# Altium schematic sheet PartsTemplate.SchDoc
size A4
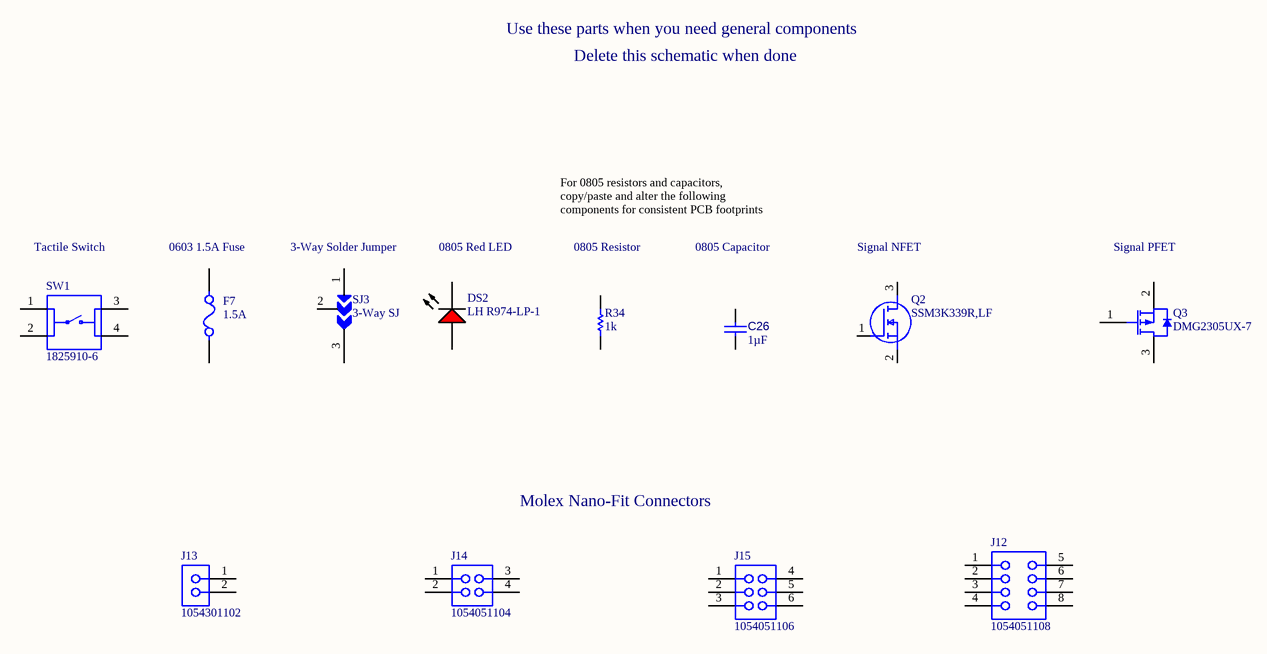
[diagram p0: PartsTemplate.SchDoc]

## Parts
C26  1µF  [CAPC2013X145X50ML20T25]
DS2  LH R974-LP-1  [OSRM-LH R974_V]
F7  1.5A  [FUSC1608X43N]
J12  1054051108  [1054051108]
J13  1054301102  [1054301102]
J14  1054051104  [1054051104]
J15  1054051106  [1054051106]
Q2  SSM3K339R,LF  [SOTFL95P240X88-3N]
Q3  DMG2305UX-7  [DIOD-SOT23-3_A_V]
R34  1k  [RESC2013X50X35ML15T15]
SJ3  3-Way SJ  [3-Way SJ]
SW1  1825910-6  [SW_1825910-6-4]

## Nets

Not connected (* = marked no-connect by the designer): C26 1 2; DS2 1(A) 2(K); F7 1 2; J12 1 2 3 4 5 6 7 8; J13 1 2; J14 1 2 3 4; J15 1 2 3 4 5 6; Q2 1(G) 2(S) 3(D); Q3 1(GATE) 2(SOURCE) 3(DRAIN); R34 1 2; SJ3 1 2 3; SW1 1 2 3 4

## Notes on the sheet
- Use these parts when you need general components
- Delete this schematic when done
- Tactile Switch
- (near F7) 0603 1.5A Fuse
- (near SJ3) 3-Way Solder Jumper
- 0805 Red LED
- For 0805 resistors and capacitors, copy/paste and alter the following components for consistent PCB footprints
- 0805 Resistor
- 0805 Capacitor
- (near Q2) Signal NFET
- Signal PFET
- Molex Nano-Fit Connectors

## Library data of the parts
C26 = CMP-001-00010-4: Chip Capacitor, 1 uF, +/-10%, 25 V, 0805 (2012 Metric); Tolerance: 10%; Capacitor Type: Ceramic; Voltage Rating: 25V; Mounting Technology: SM; Case/Package: 0805; Max Operating Temperature: 125°C; RoHS Compliant: True; Value: 1µF; Min Operating Temperature: -55°C; Pins: 2
DS2 = CMP-2000-06540-1: LED Uni-Color Red, 1.8 V, -30 to 85 degC, 2-Pin SMD, RoHS, Tape and Reel; Manufacturer: OSRAM; Dominant Wave Length: 645nm; Peak Wavelength: 660nm; Chip Material: GaAlAs; Main Category: ChipLED; Luminous Intensity: 71mcd; Rad Hardened: No; Product Depth (mm): 1.35mm; Test Current (It): 20mA; Lens Type: ColorlessDiffused; Forward Current: 30mA; Viewing Angle: 160deg; Product Length (mm): 2.1mm; Reverse Voltage: 5V; Number of  Elements: 1; Luminous Flux: 0.17lm; Shape Type: Rectangular; Product Height (mm): 0.9mm; Forward Voltage: 2.6V; Package Description: 2-Pin Surface Mount Device, Body 1.25 x 2 mm; Operating Temperature Classification: Commercial; Emitting Color: Red; Pin Count: 2; Type: Uni-Color; Packaging: TapeandReel; High Brightness: No; Datasheet URL: https://datasheet.ciiva.com/26941/getdatasheetpartid-258950-26941914.pdf; Operating Temp Range: -30Cto85C; Lens Dimensions: 1.4x1.35x0.5mm; Package Type: ChipLed; Datasheet Version: Rev. 1.0, 11/2012; Mounting Technology: SurfaceMount; Manufacturer URL: https://www.osram.com/corporate/; Package Reference: LH R974; Mounting: SurfaceMount
F7 = 046701.5NR: 1.5A 0603 Fuse; Manufacturer_Name: LITTELFUSE; Datasheet Link: https://www.littelfuse.com/~/media/electronics/datasheets/fuses/littelfuse_fuse_467_datasheet.pdf.pdf; Height: 0.432mm; Manufacturer_Part_Number: 046701.5NR; Arrow Part Number: 046701.5NR; Arrow Price/Stock: https://www.arrow.com/en/products/046701.5nr/littelfuse; Mouser Part Number: 576-046701.5NR; Mouser Price/Stock: https://www.mouser.com/Search/Refine.aspx?Keyword=576-046701.5NR; Value: 1.5A
J12 = 1054051108: Nano-Fit Right-Angle Header, Surface Mount, 2.50mm Pitch, Dual Row, 8 Circuits, 0.76µm Tin (Sn) Plating, Black, Glow-Wire Capable; Manufacturer: Molex; Part Number: 1053141108; Pitch: 2.5mm; ComponentLink2URL: https://www.molex.com/webdocs/datasheets/pdf/en-us/1054051108_PCB_HEADERS.pdf; ComponentLink2Description: Datasheet; Orientation: Right; Mounting Technology: Surface Mount
J13 = 1054301102: Nano-Fit Right-Angle Header, Surface Mount, 2.50mm Pitch, Single Row, 2 Circuits, 0.76µm Tin (Sn) Plating, Black, Glow-Wire Capable; Manufacturer: Molex; Pitch: 2.5 mm; Part Number: 1054301102; ComponentLink2Description: Datasheet; Mounting Technology: Surface Mount; ComponentLink2URL: https://www.molex.com/webdocs/datasheets/pdf/en-us/1054301102_PCB_HEADERS.pdf; Orientation: Right
J14 = 1054051104: Nano-Fit Right-Angle Header, Surface Mount, 2.50mm Pitch, Dual Row, 4 Circuits, 0.76µm Tin (Sn) Plating, Black, Glow-Wire Capable; Manufacturer: Molex; Pitch: 2.5 mm; Part Number: 1054051104; ComponentLink2Description: Datasheet; Mounting Technology: Surface Mount; ComponentLink2URL: https://www.molex.com/webdocs/datasheets/pdf/en-us/1054051104_PCB_HEADERS.pdf; Orientation: Right
J15 = 1054051106: Nano-Fit Right-Angle Header, Surface Mount, 2.50mm Pitch, Dual Row, 6 Circuits, 0.76µm Tin (Sn) Plating, Black, Glow-Wire Capable; Manufacturer: Molex; Pitch: 2.5 mm; Part Number: 1054051106; ComponentLink2Description: Datasheet; Mounting Technology: Surface Mount; ComponentLink2URL: https://www.molex.com/webdocs/datasheets/pdf/en-us/1054051106_PCB_HEADERS.pdf; Orientation: Right
Q2 = SSM3K339R,LF: MOSFET (N-Channel); Manufacturer_Name: Toshiba; Datasheet Link: https://www.arrow.com/en/products/ssm3k339rlf/toshiba; Height: 0.88mm; Manufacturer_Part_Number: SSM3K339R,LF; Arrow Part Number: SSM3K339R,LF; Arrow Price/Stock: https://www.arrow.com/en/products/ssm3k339rlf/toshiba; Mouser Part Number: 757-SSM3K339RLF; Mouser Price/Stock: https://www.mouser.co.uk/ProductDetail/Toshiba/SSM3K339RLF?qs=vPP9GyyTAo2h4IM%252B%252BLvR%252BA%3D%3D
Q3 = CMP-1693-00002-3: P-Channel Enhancement Mode MOSFET, 20 V, -55 to 150 degC, 3-Pin SOT23, RoHS, Tape and Reel; RoHSCompliant: True; Pins: 3; PackageDescription: 3-Pin Small Outline Transistor, Body 2.9 x 1.3 mm, Pitch 0.915 mm; Min Operating Temperature: -55 degC; Mounting Technology: Surface Mount; ComponentLink2URL: http://www.diodes.com/_files/datasheets/DMG2305UX.pdf; PartNumber: DMG2305UX-7; ComponentLink1URL: http://www.diodes.com/; DatasheetVersion: Rev. 5-2; Max Operating Temperature: 150 degC; Packaging: Tape and Reel; Radiation Hardening: No; ComponentLink1Description: Manufacturer URL; Case/Package: TO-236-3; ComponentLink2Description: Datasheet; Package Quantity: 1; Mount: Surface Mount
R34 = CMP-009-00001-4: Chip Resistor, 1k Ohm, +/- 1%, 125 mW, -55 to 155 degC, 0805 (2012 Metric); Power: 125mW; Voltage Rating: 150V; Tolerance: 1%; Mounting Technology: SM; Value: 1k; Min Operating Temperature: -55°C; Case/Package: 0805; Pins: 2; Max Operating Temperature: 155°C; RoHS Compliant: True
SJ3 = 3-Way SJ: 3-Way Solder Jumper
SW1 = 1825910-6: Switch Push Button OFF _ON_ SPST Round Button 0.05A 24VDC Momentary Contact PC Pins Thru-Hole; Configuration_Pole-Throw: Single Pole - Single Throw; MF: TE Connectivity; Contact_Current_Rating: 50 mA; Digi-Key_Purchase_URL: https://www.digikey.com/product-detail/en/te-connectivity-alcoswitch-switches/1825910-6/450-1650-ND/1632536?utm_source=snapeda&utm_medium=aggregator&utm_campaign=symbol; TE_purchase_URL: https://www.te.com/usa-en/product-1825910-6.html?te_bu=Cor&te_type=disp&te_campaign=seda_glo_cor-seda-global-disp-prtnr-fy19-seda-model-bom-cta_sma-317_1&elqCampaignId=32493; Value: *; Digi-Key_Part_Number: 450-1650-ND; SnapEDA_Link: https://www.snapeda.com/parts/1825910-6/TE%20Connectivity%20ALCOSWITCH%20Switches/view-part/424522/?ref=snap; EU_RoHS_Compliance: Compliant; MP: 1825910-6; Package: None